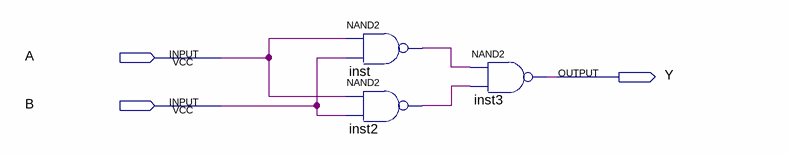
[diagram p0: schematic sheet]
// Quartus schematic Block6.bdf as structural Verilog: 3 symbols, 3 pins
module Block6 (
  input  A,
  input  B,
  output Y
);

  wire inst2_out, inst_out;

  nand inst (inst_out, A, B);
  nand inst2 (inst2_out, A, B);
  nand inst3 (Y, inst_out, inst2_out);
endmodule
